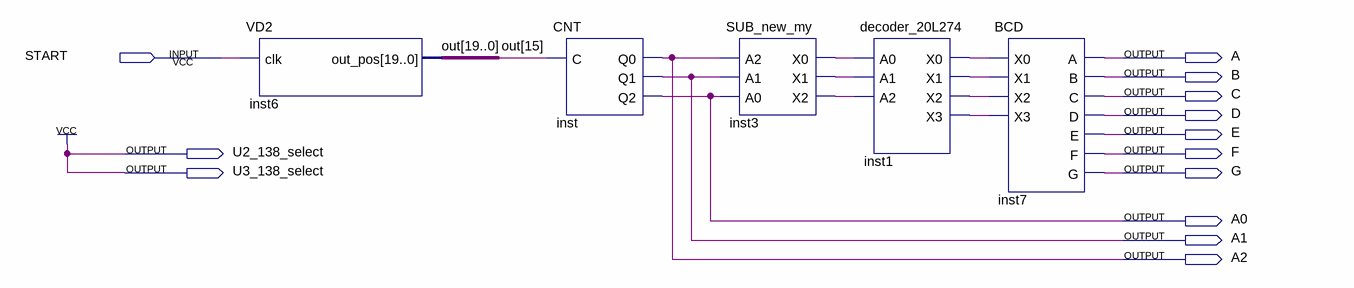
[diagram p0: schematic sheet]
// Quartus schematic counter.bdf as structural Verilog: 5 symbols, 13 pins
module counter (
  input  START,
  output A,
  output B,
  output C,
  output D,
  output E,
  output U2_138_select,
  output F,
  output U3_138_select,
  output G,
  output A0,
  output A1,
  output A2
);

  wire inst1_x0, inst1_x1, inst1_x2, inst1_x3, inst3_x0, inst3_x1, inst3_x2;
  wire [19:0] out;

  VD2 inst6 (.clk(START), .out_pos(out));
  CNT inst (.C(out[15]), .Q0(A2), .Q1(A1), .Q2(A0));
  SUB_new_my inst3 (.A2(A2), .A1(A1), .A0(A0), .X0(inst3_x0), .X1(inst3_x1), .X2(inst3_x2));
  decoder_20L274 inst1 (
    .A0(inst3_x0), .A1(inst3_x1), .A2(inst3_x2), .X0(inst1_x0), .X1(inst1_x1), .X2(inst1_x2), .X3(inst1_x3));
  BCD inst7 (
    .X0(inst1_x0), .X1(inst1_x1), .X2(inst1_x2), .X3(inst1_x3), .A(A), .B(B), .C(C), .D(D), .E(E), .F(F),
    .G(G));

  assign U2_138_select = 1'b1;
  assign U3_138_select = 1'b1;
endmodule
